# Altium schematic sheet project_cdh.SchDoc
size A4; SheetNumber: 1; SheetTotal: 5
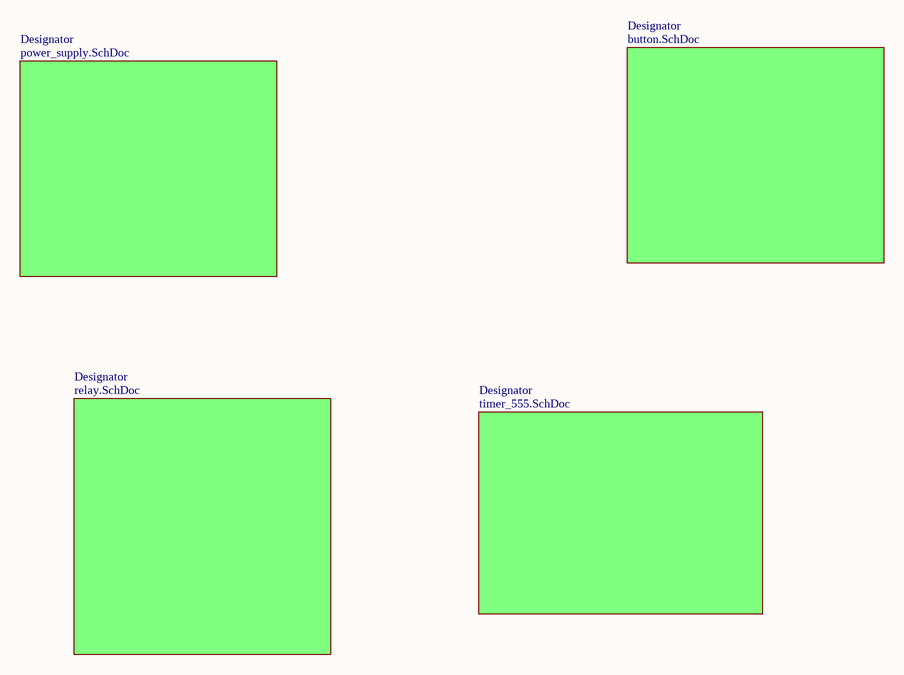
[diagram p0: project_cdh.SchDoc]

## Sub-sheets
Designator = power_supply.SchDoc: no entries
Designator = button.SchDoc: no entries
Designator = relay.SchDoc: no entries
Designator = timer_555.SchDoc: no entries